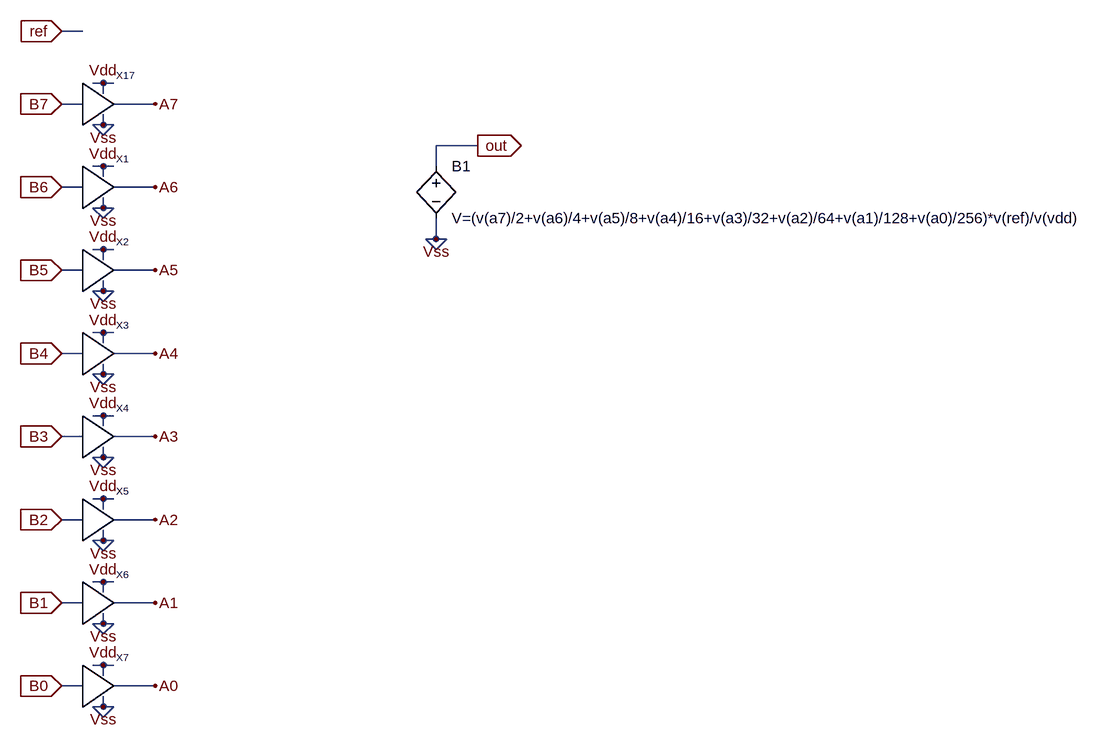
[diagram p0: schematic 8bitdac.asc]
8bitdac.asc, the LTspice schematic file:
Version 4
SHEET 1 1792 1084
WIRE 96 0 64 0
WIRE 128 80 112 80
WIRE 144 80 128 80
WIRE 128 96 128 80
WIRE 96 112 64 112
WIRE 208 112 144 112
WIRE 128 144 128 128
WIRE 128 144 112 144
WIRE 144 144 128 144
WIRE 128 160 112 144
WIRE 128 160 144 144
WIRE 704 176 640 176
WIRE 128 208 112 208
WIRE 144 208 128 208
WIRE 640 208 640 176
WIRE 128 224 128 208
WIRE 96 240 64 240
WIRE 208 240 144 240
WIRE 128 272 128 256
WIRE 128 272 112 272
WIRE 144 272 128 272
WIRE 128 288 112 272
WIRE 128 288 144 272
WIRE 640 320 640 288
WIRE 640 320 624 320
WIRE 656 320 640 320
WIRE 128 336 112 336
WIRE 144 336 128 336
WIRE 640 336 624 320
WIRE 640 336 656 320
WIRE 128 352 128 336
WIRE 96 368 64 368
WIRE 208 368 144 368
WIRE 128 400 128 384
WIRE 128 400 112 400
WIRE 144 400 128 400
WIRE 128 416 112 400
WIRE 128 416 144 400
WIRE 128 464 112 464
WIRE 144 464 128 464
WIRE 128 480 128 464
WIRE 96 496 64 496
WIRE 208 496 144 496
WIRE 128 528 128 512
WIRE 128 528 112 528
WIRE 144 528 128 528
WIRE 128 544 112 528
WIRE 128 544 144 528
WIRE 128 592 112 592
WIRE 144 592 128 592
WIRE 128 608 128 592
WIRE 96 624 64 624
WIRE 208 624 144 624
WIRE 128 656 128 640
WIRE 128 656 112 656
WIRE 144 656 128 656
WIRE 128 672 112 656
WIRE 128 672 144 656
WIRE 128 720 112 720
WIRE 144 720 128 720
WIRE 128 736 128 720
WIRE 96 752 64 752
WIRE 208 752 144 752
WIRE 128 784 128 768
WIRE 128 784 112 784
WIRE 144 784 128 784
WIRE 128 800 112 784
WIRE 128 800 144 784
WIRE 128 848 112 848
WIRE 144 848 128 848
WIRE 128 864 128 848
WIRE 96 880 64 880
WIRE 208 880 144 880
WIRE 128 912 128 896
WIRE 128 912 112 912
WIRE 144 912 128 912
WIRE 128 928 112 912
WIRE 128 928 144 912
WIRE 128 976 112 976
WIRE 144 976 128 976
WIRE 128 992 128 976
WIRE 96 1008 64 1008
WIRE 208 1008 144 1008
WIRE 128 1040 128 1024
WIRE 128 1040 112 1040
WIRE 144 1040 128 1040
WIRE 128 1056 112 1040
WIRE 128 1056 144 1040
FLAG 704 176 out
IOPIN 704 176 Out
FLAG 64 0 ref
IOPIN 64 0 In
FLAG 64 112 B7
IOPIN 64 112 In
FLAG 64 240 B6
IOPIN 64 240 In
FLAG 64 368 B5
IOPIN 64 368 In
FLAG 64 496 B4
IOPIN 64 496 In
FLAG 640 320 Vss
FLAG 128 80 Vdd
FLAG 128 144 Vss
FLAG 208 112 A7
FLAG 128 208 Vdd
FLAG 128 272 Vss
FLAG 208 240 A6
FLAG 128 336 Vdd
FLAG 128 400 Vss
FLAG 208 368 A5
FLAG 128 464 Vdd
FLAG 128 528 Vss
FLAG 208 496 A4
FLAG 64 624 B3
IOPIN 64 624 In
FLAG 64 752 B2
IOPIN 64 752 In
FLAG 64 880 B1
IOPIN 64 880 In
FLAG 64 1008 B0
IOPIN 64 1008 In
FLAG 128 592 Vdd
FLAG 128 656 Vss
FLAG 208 624 A3
FLAG 128 720 Vdd
FLAG 128 784 Vss
FLAG 208 752 A2
FLAG 128 848 Vdd
FLAG 128 912 Vss
FLAG 208 880 A1
FLAG 128 976 Vdd
FLAG 128 1040 Vss
FLAG 208 1008 A0
SYMBOL bv 640 192 R0
SYMATTR InstName B1
SYMATTR Value V=(v(a7)/2+v(a6)/4+v(a5)/8+v(a4)/16+v(a3)/32+v(a2)/64+v(a1)/128+v(a0)/256)*v(ref)/v(vdd)
SYMBOL buff 96 144 R0
SYMATTR InstName X17
SYMBOL buff 96 272 R0
SYMATTR InstName X1
SYMBOL buff 96 400 R0
SYMATTR InstName X2
SYMBOL buff 96 528 R0
SYMATTR InstName X3
SYMBOL buff 96 656 R0
SYMATTR InstName X4
SYMBOL buff 96 784 R0
SYMATTR InstName X5
SYMBOL buff 96 912 R0
SYMATTR InstName X6
SYMBOL buff 96 1040 R0
SYMATTR InstName X7

The netlist it stands for:
* 8bitdac.asc
B1 out Vss V=(v(a7)/2+v(a6)/4+v(a5)/8+v(a4)/16+v(a3)/32+v(a2)/64+v(a1)/128+v(a0)/256)*v(ref)/v(vdd)
XX17 Vdd Vss B7 A7 buff  ; pins Vdd Vss IN OUT
XX1 Vdd Vss B6 A6 buff  ; pins Vdd Vss IN OUT
XX2 Vdd Vss B5 A5 buff  ; pins Vdd Vss IN OUT
XX3 Vdd Vss B4 A4 buff  ; pins Vdd Vss IN OUT
XX4 Vdd Vss B3 A3 buff  ; pins Vdd Vss IN OUT
XX5 Vdd Vss B2 A2 buff  ; pins Vdd Vss IN OUT
XX6 Vdd Vss B1 A1 buff  ; pins Vdd Vss IN OUT
XX7 Vdd Vss B0 A0 buff  ; pins Vdd Vss IN OUT
.backanno
.end